# EAGLE design siggen1modified (EAGLE 4.16)
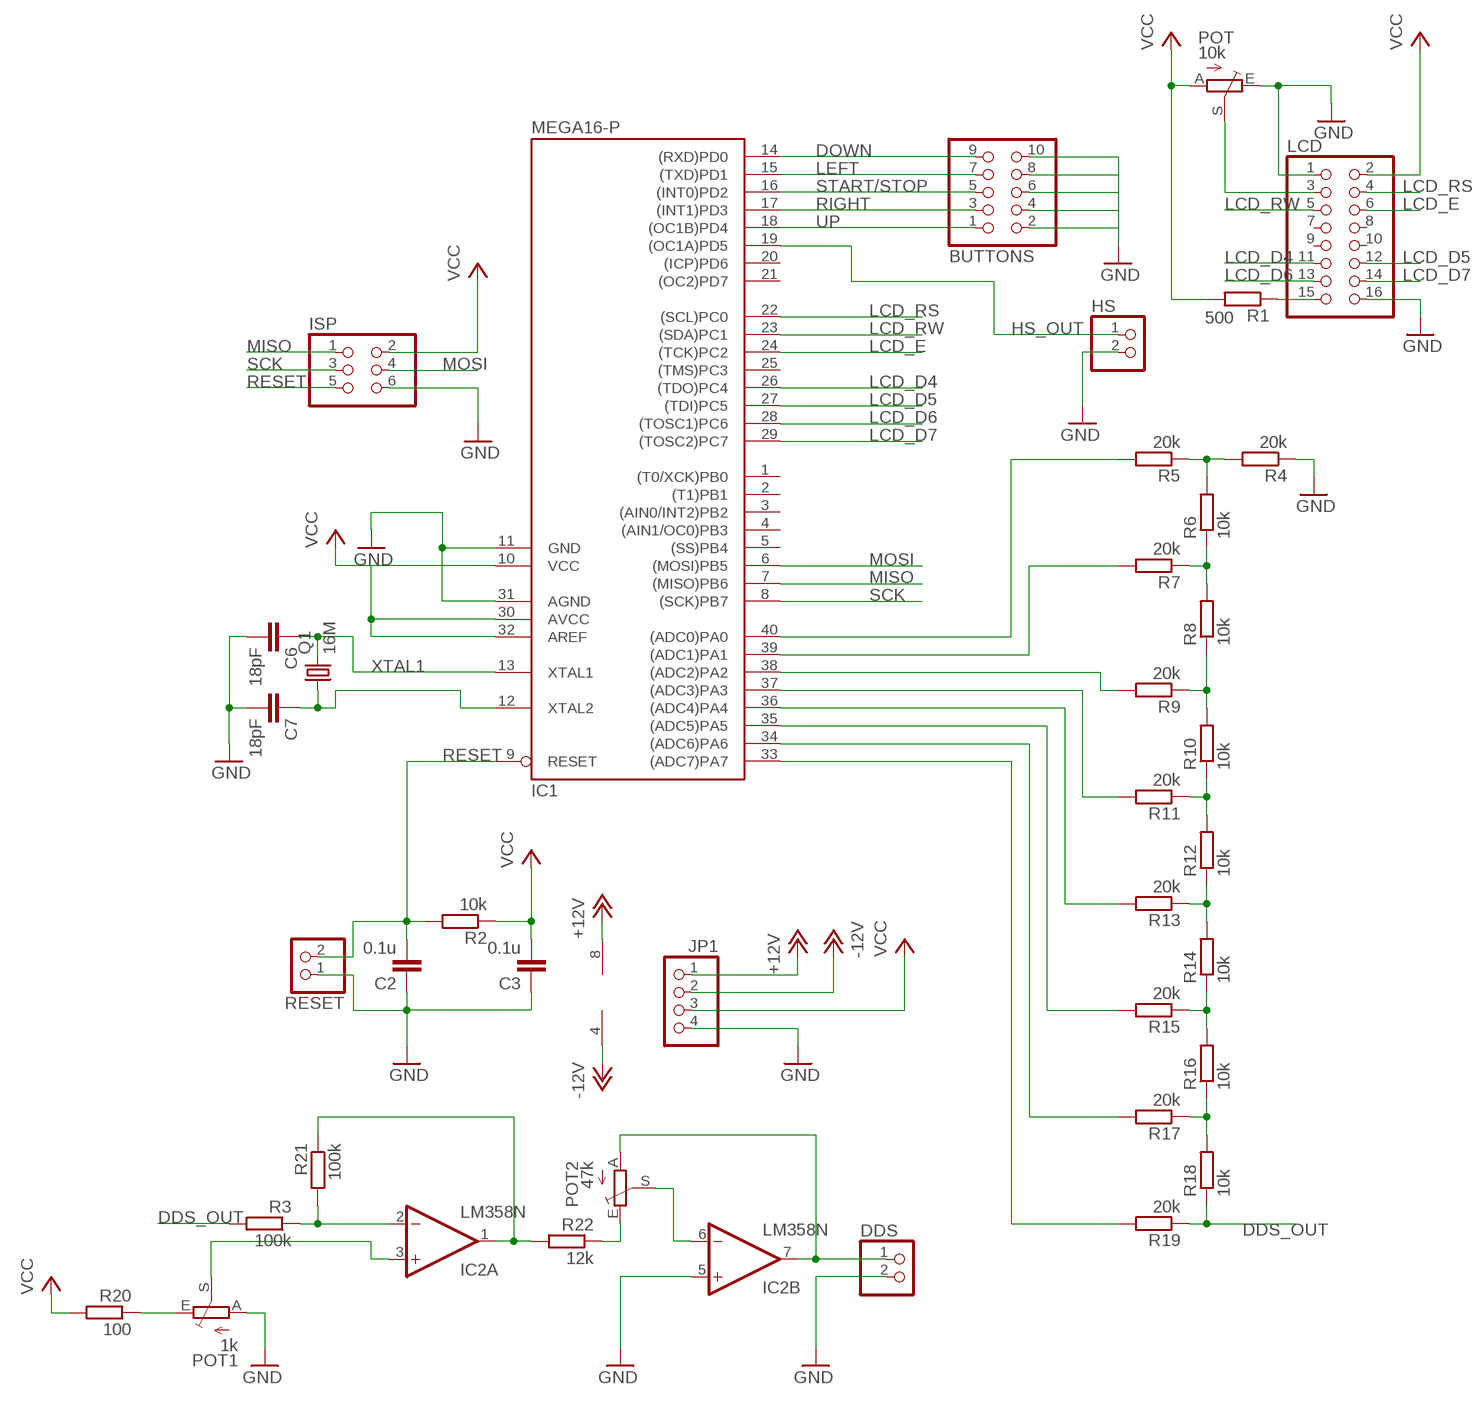
[diagram p0: schematic, sheet 1]

## Parts
BUTTONS  PINHD-2X5  [2X05]
C2  0.1u  C-EUC0805  [C0805]
C3  0.1u  C-EUC0805  [C0805]
C6  18pF  C-EUC0805  [C0805]
C7  18pF  C-EUC0805  [C0805]
DDS  PINHD-1X2  [1X02]
HS  PINHD-1X2  [1X02]
IC1  MEGA16-P  [DIL40]
IC2  LM358N  [DIL08]
ISP  PINHD-2X3  [2X03]
JP1  PINHD-1X4  [1X04]
LCD  PINHD-2X8  [2X08]
POT  10k  TRIM_EU-B64W  [B64W]
POT1  1k  TRIM_EU-B64W  [B64W]
POT2  47k  TRIM_EU-B64W  [B64W]
Q1  16M  CRYTALHC49S  [HC49/S]
R1  500  R-EU_M0805  [M0805]
R2  10k  R-EU_R0805  [R0805]
R3  100k  R-EU_M0805  [M0805]
R4  20k  R-EU_M0805  [M0805]
R5  20k  R-EU_M0805  [M0805]
R6  10k  R-EU_M0805  [M0805]
R7  20k  R-EU_M0805  [M0805]
R8  10k  R-EU_M0805  [M0805]
R9  20k  R-EU_M0805  [M0805]
R10  10k  R-EU_M0805  [M0805]
R11  20k  R-EU_M0805  [M0805]
R12  10k  R-EU_M0805  [M0805]
R13  20k  R-EU_M0805  [M0805]
R14  10k  R-EU_M0805  [M0805]
R15  20k  R-EU_M0805  [M0805]
R16  10k  R-EU_M0805  [M0805]
R17  20k  R-EU_M0805  [M0805]
R18  10k  R-EU_M0805  [M0805]
R19  20k  R-EU_M0805  [M0805]
R20  100  R-EU_M0805  [M0805]
R21  100k  R-EU_M0805  [M0805]
R22  12k  R-EU_M0805  [M0805]
RESET  PINHD-1X2  [1X02]

## Nets
+12V: IC2.8(P:V+) JP1.1
-12V: IC2.4(P:V-) JP1.2
DDS_OUT: R3.2 R18.1 R19.1
DOWN: BUTTONS.9 IC1.14((RXD)PD0)
GND: BUTTONS.2 BUTTONS.4 BUTTONS.6 BUTTONS.8 BUTTONS.10 C2.1 C3.1 C6.2 C7.2 DDS.2 HS.2 IC1.11(GND) IC1.31(AGND) IC2.5(B:+IN) ISP.6 JP1.4 LCD.1 LCD.16 POT1.A POT.E R4.1 RESET.1
HS_OUT: HS.1 IC1.19((OC1A)PD5)
LCD_D4: IC1.26((TDO)PC4) LCD.11
LCD_D5: IC1.27((TDI)PC5) LCD.12
LCD_D6: IC1.28((TOSC1)PC6) LCD.13
LCD_D7: IC1.29((TOSC2)PC7) LCD.14
LCD_E: IC1.24((TCK)PC2) LCD.6
LCD_RS: IC1.22((SCL)PC0) LCD.4
LCD_RW: IC1.23((SDA)PC1) LCD.5
LEFT: BUTTONS.7 IC1.15((TXD)PD1)
MISO: IC1.7((MISO)PB6) ISP.1
MOSI: IC1.6((MOSI)PB5) ISP.4
N$1: IC1.40((ADC0)PA0) R5.2
N$2: LCD.3 POT.S
N$3: IC2.2(A:-IN) R3.1 R21.2
N$5: LCD.15 R1.1
N$6: IC1.39((ADC1)PA1) R7.2
N$7: IC1.33((ADC7)PA7) R19.2
N$8: IC1.34((ADC6)PA6) R17.2
N$9: IC1.35((ADC5)PA5) R15.2
N$10: IC1.36((ADC4)PA4) R13.2
N$11: IC1.37((ADC3)PA3) R11.2
N$12: IC1.38((ADC2)PA2) R9.2
N$13: POT2.E R22.1
N$14: IC2.3(A:+IN) POT1.S
N$15: R4.2 R5.1 R6.2
N$16: IC2.1(A:OUT) R21.1 R22.2
N$17: POT1.E R20.1
N$18: R6.1 R7.1 R8.2
N$19: DDS.1 IC2.7(B:OUT) POT2.A
N$20: R8.1 R9.1 R10.2
N$21: R10.1 R11.1 R12.2
N$22: R12.1 R13.1 R14.2
N$23: R14.1 R15.1 R16.2
N$24: R16.1 R17.1 R18.2
N$25: IC2.6(B:-IN) POT2.S
N$29: C7.1 IC1.12(XTAL2) Q1.1
RESET: C2.2 IC1.9(RESET) ISP.5 R2.2 RESET.2
RIGHT: BUTTONS.3 IC1.17((INT1)PD3)
SCK: IC1.8((SCK)PB7) ISP.3
START/STOP: BUTTONS.5 IC1.16((INT0)PD2)
UP: BUTTONS.1 IC1.18((OC1B)PD4)
VCC: C3.2 IC1.10(VCC) IC1.30(AVCC) IC1.32(AREF) ISP.2 JP1.3 LCD.2 POT.A R1.2 R2.1 R20.2
XTAL1: C6.1 IC1.13(XTAL1) Q1.2
Unconnected: IC1.1((T0/XCK)PB0) IC1.2((T1)PB1) IC1.3((AIN0/INT2)PB2) IC1.4((AIN1/OC0)PB3) IC1.5((SS)PB4) IC1.20((ICP)PD6) IC1.21((OC2)PD7) IC1.25((TMS)PC3) LCD.7 LCD.8 LCD.9 LCD.10

## Library data of the parts
BUTTONS = pinhead:PINHD-2X5: PIN HEADER
C2 C3 C6 C7 = rcl:C-EU: CAPACITOR, European symbol
DDS HS RESET = pinhead:PINHD-1X2: PIN HEADER
IC1 = atmel:MEGA16-P: MICROCONTROLLER 16 Kbytes FLASH 1 kbytes SRAM 512 bytes EEPROM USART 8-channel 10 bit ADC Source: avr.lbr
IC2 = linear:LM358: OP AMP also LM158; LM258; LM2904 Source: http://cache.national.com/ds/LM/LM158.pdf
ISP = pinhead:PINHD-2X3: PIN HEADER
JP1 = pinhead:PINHD-1X4: PIN HEADER
LCD = pinhead:PINHD-2X8: PIN HEADER
POT POT1 POT2 = pot:TRIM_EU-: POTENTIOMETER
Q1 = crystal:CRYTAL: CRYSTAL
R1-R22 = rcl:R-EU_: RESISTOR, European symbol

## Board
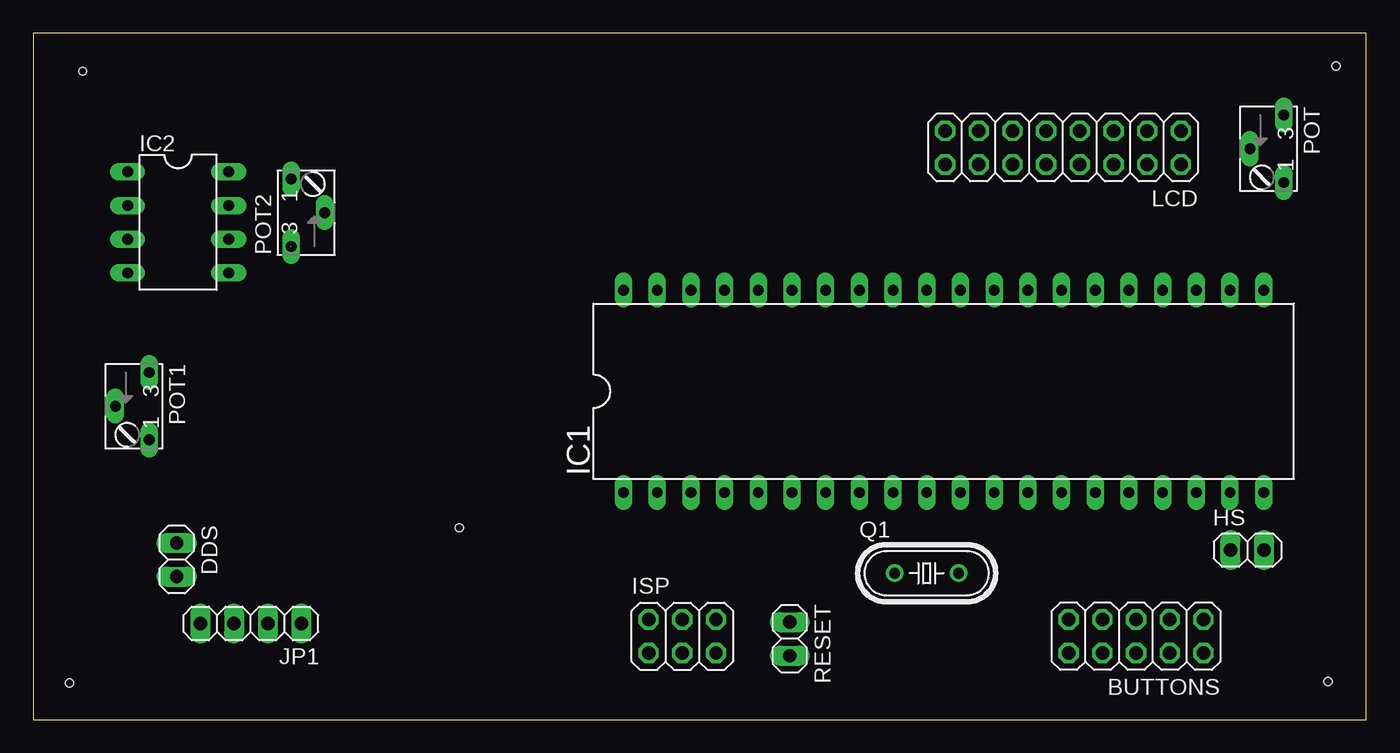
[diagram p1: board, top side]
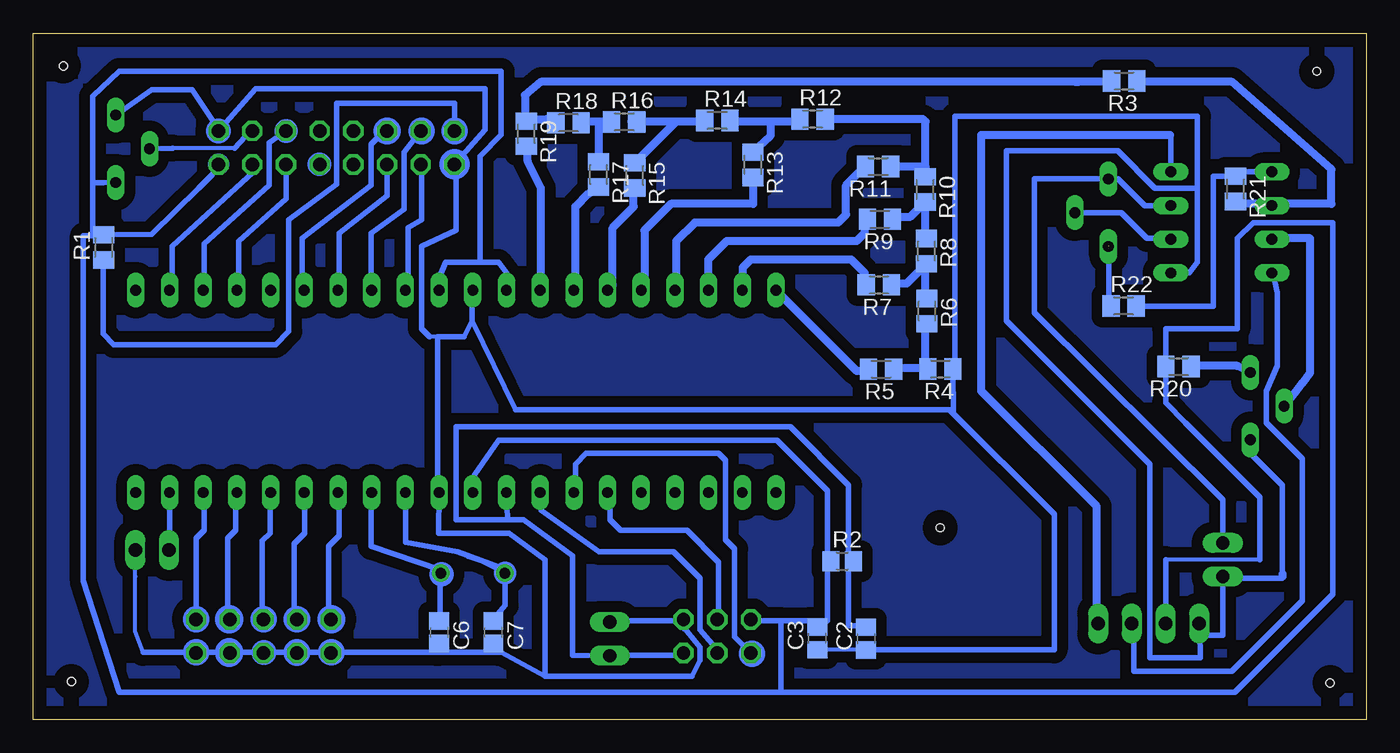
[diagram p2: board, bottom side, seen from below]

Size 100.51 x 51.74 mm. Coordinates in mm from the lower left corner, seen from the top.
Outline: 0,0 100.51,0 100.51,51.74 0,51.74 0,0
Copper layers (1*16): Top 0.035mm / dielectric 1.5mm / Bottom 0.035mm
Design rules "default": minimum track width 10mil, minimum drill 24mil, track to track 8mil, track to pad 8mil, pad to pad 8mil, via to via 8mil, smd to smd 8mil, copper to edge 40mil, drill to drill 8mil, minimum pad ring 10mil, minimum via ring 8mil, stop-mask expansion 4mil, vias tented up to drill 0mil, thermal gap 10mil
Holes 0.6 mm at 32.13,14.47 97.63,2.87 32.13,14.47 98.23,49.27 3.73,48.87 2.73,2.77 98.23,49.27 97.63,2.87

### Footprints (pad centres in the part's own frame; a part is rotated, then mirrored left to right if it is on the bottom)
2X05 = drill 1.016 octagon: 1 -5.08,-1.27; 2 -5.08,1.27; 3 -2.54,-1.27; 4 -2.54,1.27; 5 0,-1.27; 6 0,1.27; 7 2.54,-1.27; 8 2.54,1.27; 9 5.08,-1.27; 10 5.08,1.27
C0805 = smd 1.3 x 1.5: 1 -0.85,0; 2 0.85,0
1X02 = drill 1.016 long: 1 -1.27,0; 2 1.27,0
DIL40 = drill 0.813 long: 1 -24.13,-7.62; 2 -21.59,-7.62; 3 -19.05,-7.62; 4 -16.51,-7.62; 5 -13.97,-7.62; 6 -11.43,-7.62; 7 -8.89,-7.62; 8 -6.35,-7.62; 9 -3.81,-7.62; 10 -1.27,-7.62; 11 1.27,-7.62; 12 3.81,-7.62; 13 6.35,-7.62; 14 8.89,-7.62; 15 11.43,-7.62; 16 13.97,-7.62; 17 16.51,-7.62; 18 19.05,-7.62; 19 21.59,-7.62; 20 24.13,-7.62; 21 24.13,7.62; 22 21.59,7.62; 23 19.05,7.62; 24 16.51,7.62; 25 13.97,7.62; 26 11.43,7.62; 27 8.89,7.62; 28 6.35,7.62; 29 3.81,7.62; 30 1.27,7.62; 31 -1.27,7.62; 32 -3.81,7.62; 33 -6.35,7.62; 34 -8.89,7.62; 35 -11.43,7.62; 36 -13.97,7.62; 37 -16.51,7.62; 38 -19.05,7.62; 39 -21.59,7.62; 40 -24.13,7.62
DIL08 = drill 0.813 long: 1 -3.81,-3.81; 2 -1.27,-3.81; 3 1.27,-3.81; 4 3.81,-3.81; 5 3.81,3.81; 6 1.27,3.81; 7 -1.27,3.81; 8 -3.81,3.81
2X03 = drill 1.016 octagon: 1 -2.54,-1.27; 2 -2.54,1.27; 3 0,-1.27; 4 0,1.27; 5 2.54,-1.27; 6 2.54,1.27
1X04 = drill 1.016 long: 1 -3.81,0; 2 -1.27,0; 3 1.27,0; 4 3.81,0
2X08 = drill 1.016 octagon: 1 -8.89,-1.27; 2 -8.89,1.27; 3 -6.35,-1.27; 4 -6.35,1.27; 5 -3.81,-1.27; 6 -3.81,1.27; 7 -1.27,-1.27; 8 -1.27,1.27; 9 1.27,-1.27; 10 1.27,1.27; 11 3.81,-1.27; 12 3.81,1.27; 13 6.35,-1.27; 14 6.35,1.27; 15 8.89,-1.27; 16 8.89,1.27
B64W = drill 0.813 long: A 2.54,0; E -2.54,0; S 0,-2.54
HC49/S = drill 0.813 round: 1 -2.413,0; 2 2.413,0
M0805 = smd 1.3 x 1.6: 1 -0.95,0; 2 0.95,0
R0805 = smd 1.3 x 1.5: 1 -0.85,0; 2 0.85,0

### Placement (x,y rotation side)
BUTTONS  83.15,6.29 180 top
C2  37.72,6.11 90 bottom
C3  41.39,6.13 90 bottom
C6  69.9,6.59 270 bottom
C7  65.82,6.59 270 bottom
DDS  10.82,12.06 270 top
HS  91.54,12.78 0 top
IC1  68.64,24.75 0 top
IC2  10.93,37.48 270 top
ISP  48.94,6.29 0 top
JP1  16.41,7.25 180 top
LCD  77.64,43.11 180 top
POT  94.28,43.03 270 top
POT1  8.74,23.63 270 top
POT2  19.44,38.21 90 top
Q1  67.36,11.04 0 top
R1  95.2,35.6 90 bottom
R2  39.51,11.95 0 bottom
R3  18.26,48.14 180 bottom
R4  32.11,26.43 180 bottom
R5  36.59,26.41 180 bottom
R6  33.13,30.8 270 bottom
R7  36.75,32.77 180 bottom
R8  33.17,35.31 270 bottom
R9  36.67,37.71 180 bottom
R10  33.26,39.97 270 bottom
R11  36.81,41.69 180 bottom
R12  41.75,45.26 0 bottom
R13  46.25,41.82 270 bottom
R14  48.93,45.16 0 bottom
R15  55.15,41.02 270 bottom
R16  55.95,45.04 0 bottom
R17  57.89,41.1 270 bottom
R18  60.16,44.98 0 bottom
R19  63.33,44.16 270 bottom
R20  14.16,26.62 180 bottom
R21  9.86,40 270 bottom
R22  18.3,31.18 0 bottom
RESET  57.04,6.09 270 top

### Tracks (layer width: path | path; a pad name or v marks a point on that pad's centre or on a via)
+12V
  Bottom 0.406: IC2.8 14.73,44.07 14.78,44.07
  Bottom 0.61: 14.78,44.07 29.03,44.07 29.03,24.77 20.33,16.07 20.33,6.24 | 20.33,6.24 20.33,6.17 | JP1.1 20.33,6.24
-12V
  Bottom 0.305: 17.53,6.4 JP1.2 | 7.03,33.57 6.98,33.67
  Bottom 0.406: 17.53,6.4 17.53,3.67 10.13,3.67 4.83,8.97 4.83,19.67 7.53,22.37 7.53,24.77 6.73,26.67 6.73,32.17 7.03,33.57 IC2.4
DDS_OUT
  Bottom 0.61: R18.1 61.8,45.27 63.37,45.27 R19.1 63.29,45.07 63.43,45.07 63.43,47.07 62.23,48.07 21.93,48.07 | 21.93,48.07 21.74,48.07 | R3.2 19.28,48.07 21.93,48.07
DOWN
  Bottom 0.305: BUTTONS.9 78.23,7.72 | 77.43,17.07 77.47,17.07 IC1.14
  Bottom 0.406: 78.23,7.72 78.23,13.07 77.43,13.87 77.43,17.07
GND
  Bottom 0.254: C7.2 65.43,5.07 | C6.2 69.93,5.07 | 77.43,5.07 BUTTONS.10 | 51.23,6.67 51.43,6.87 | 31.03,27.17 R4.1
  Bottom 0.305: IC1.31 67.43,31.31 67.43,30.07 | 70.03,28.87 70.63,28.87 | 68.63,41.92 68.73,42.07 | 68.73,42.07 LCD.16 68.63,41.86 68.73,42.07 | LCD.1 86.73,44.77 | 68.73,42.07 68.73,41.87 | 88.43,5.07 BUTTONS.2 88.08,5.07 | 92.22,5.07 92.83,6.67 92.81,10.79 HS.2 | 85.83,5.07 85.83,4.88 BUTTONS.4 85.64,5.07 | 83.2,5.07 BUTTONS.6 83,5.07 | 80.43,4.87 80.46,5.07 BUTTONS.8 80.56,5.07 | 78.03,5.07 78.03,5.06 BUTTONS.10 | 51.43,7.47 51.43,7.51 ISP.6 | 56.93,7.47 RESET.1 | 12.53,6.37 12.53,6.42 JP1.4 | C3.1 41.43,5.27 | C3.1 | C3.1 C2.1 37.63,5.17
  Bottom 0.406: 8.83,20.17 6.33,17.67 6.33,10.97 6.33,10.67 10.93,10.67 10.93,10.79 DDS.2 10.83,6.37 12.53,6.37 | 6.33,10.8 6.33,10.77 | 67.43,30.07 68.03,28.87 70.03,28.87 70.03,18.27 IC1.11 69.93,14.07 64.63,14.07 61.93,12.07 61.93,3.27 | 70.63,28.87 71.23,29.47 71.23,35.67 68.63,36.87 68.63,41.86 68.63,41.92 | POT.E 91.58,47.47 88.53,47.47 86.73,44.77 | LCD.1 83.74,47.57 66.43,47.57 66.43,44.47 68.73,41.87 | 88.43,5.07 92.22,5.07 | 85.83,5.07 88.08,5.07 | 83.2,5.07 85.64,5.07 | 80.46,5.07 83,5.07 | 78.03,5.07 80.46,5.07 | 80.46,5.07 80.56,5.07 | 51.43,7.47 56.93,7.47 | R4.1 31.13,23.1 31.43,23.37 | 31.43,23.37 23.53,15.47 23.53,5.27 C2.1 | 65.43,5.07 69.93,5.07 | C6.2 70.13,5.07 69.93,5.07 | 69.93,5.07 77.43,5.07 | 51.23,6.67 50.23,5.47 50.23,4.47 50.83,3.27 61.93,3.27 | 61.93,3.27 65.23,5.07 C7.2 | 51.43,6.87 ISP.6 | 12.73,40.07 12.73,34.47 13.33,33.67 IC2.5 14.83,33.67 | 12.73,40.07 12.73,45.47 31.03,45.47 31.03,27.17 | 12.73,40.07 15.93,40.07 18.73,42.87 27.13,42.87 27.13,30.07 16.33,19.27 16.33,4.67 12.53,4.67 12.53,5.17 JP1.4 | 67.43,30.07 67.43,31.47 IC1.31 | 67.43,30.07 64.13,23.37 31.43,23.37
  Bottom 0.61: POT1.A 8.83,20.38 8.83,20.17 | 6.33,10.97 6.33,10.8
HS_OUT
  Bottom 0.305: 90.23,12.77 90.23,13.04 HS.1
  Bottom 0.406: 90.23,12.77 IC1.19
LCD_D4
  Bottom 0.305: IC1.26 80.23,32.53 | 73.63,44.77 73.74,44.47 LCD.11
  Bottom 0.406: 80.23,32.53 80.23,36.27 75.03,40.27 75.03,43.37 73.63,44.77
LCD_D5
  Bottom 0.305: IC1.27 77.43,32.47 | 73.83,41.77 73.8,41.77 LCD.12
  Bottom 0.406: 77.43,32.47 77.43,36.67 73.83,39.47 73.83,41.77
LCD_D6
  Bottom 0.305: IC1.28 75.03,32.41 | 71.23,44.47 71.23,44.44 LCD.13
  Bottom 0.406: 75.03,32.41 75.03,36.67 72.53,38.47 72.53,42.77 71.23,44.47
LCD_D7
  Bottom 0.305: IC1.29 72.23,32.59 | 71.23,41.8 LCD.14
  Bottom 0.406: 72.23,32.59 72.23,37.07 71.23,37.67 71.23,41.8
LCD_E
  Bottom 0.305: IC1.24 85.03,32.49 | 81.43,41.86 LCD.6
  Bottom 0.406: 85.03,32.49 85.03,36.07 81.43,39.27 81.43,41.86
LCD_RS
  Bottom 0.305: IC1.22 90.03,32.57 | 83.93,41.77 83.96,41.87 LCD.4
  Bottom 0.406: 90.03,32.57 90.03,35.67 83.93,41.27 83.93,41.77
LCD_RW
  Bottom 0.305: IC1.23 87.63,32.43 | 81.43,44.37 LCD.5
  Bottom 0.406: 87.63,32.43 87.63,35.87 82.73,40.27 82.73,43.47 81.43,44.37
LEFT
  Bottom 0.305: BUTTONS.7 80.83,7.78 | 80.03,17.09 IC1.15
  Bottom 0.406: 80.83,7.78 80.83,13.27 80.03,14.07 80.03,17.09
MISO
  Bottom 0.305: 59.63,17.25 IC1.7 | 46.43,5.07 46.43,5.05 ISP.1
  Bottom 0.406: 59.63,17.25 59.63,19.27 58.83,20.07 48.83,20.07 48.33,19.57 48.33,13.57 47.63,12.87 47.63,6.27 46.43,5.07
MOSI
  Bottom 0.305: 57.03,16.95 IC1.6 | 48.83,7.67 ISP.4
  Bottom 0.406: 57.03,16.95 57.03,15.07 56.23,14.27 51.23,14.27 48.83,11.87 48.83,7.67
N$1
  Bottom 0.61: R5.2 37.43,26.3 37.43,26.27 38.41,26.27 IC1.40
N$2
  Bottom 0.305: 85.33,43.07 90,43.07 | LCD.3 84.03,44.42 84.03,44.27 84.13,44.37
  Bottom 0.406: 90,43.07 POT.S | 84.13,44.37 85.33,43.07
N$3
  Bottom 0.406: IC2.2 7.13,38.77 7.13,38.87
  Bottom 0.61: R21.2 10.13,38.92 10.13,38.87 7.13,38.87 | R3.1 17.24,48.07 10.13,48.07 2.63,41.47 2.63,38.87 7.13,38.87 | 7.13,38.87 7.1,38.87
N$4
  pour Bottom (isolate 0.813): 0.23,51.67 100.43,51.87 100.43,0.07 0.03,0.07
N$5
  Bottom 0.305: R1.1 95.28,34.57 95.13,34.17 95.23,34.57 95.23,34.17
  Bottom 0.406: LCD.15 68.74,46.47 77.63,46.47 77.63,40.37 81.23,37.67 81.23,29.27 82.23,28.27 94.43,28.27 95.23,29.07 95.23,34.17
N$6
  Bottom 0.61: IC1.39 47.03,32.39 47.03,34.07 46.43,34.67 38.83,34.67 37.83,33.67 37.83,32.87 37.8,32.87 R7.2
N$7
  Bottom 0.61: IC1.33 62.23,32.43 62.23,40.07 63.23,42.07 63.23,43.11 R19.2
N$8
  Bottom 0.61: IC1.34 59.63,32.49 59.63,38.67 58.63,39.67 58.57,39.67 R17.2
N$9
  Bottom 0.61: IC1.35 56.83,32.75 56.83,37.07 55.23,38.67 55.23,40.07 R15.2
N$10
  Bottom 0.61: IC1.36 54.43,32.61 54.43,36.87 52.43,38.87 46.23,38.87 46.23,40.85 R13.2
N$11
  Bottom 0.61: IC1.37 52.03,32.47 52.03,36.07 50.63,37.47 39.83,37.47 39.23,38.07 39.23,40.27 38.03,41.47 38.03,41.67 37.78,41.67 R11.2
N$12
  Bottom 0.61: IC1.38 49.63,32.41 49.63,34.67 48.23,36.07 38.43,36.07 37.83,36.67 37.83,37.5 R9.2
N$13  (1 unrouted)
  Bottom 0.406: 19.43,35.65 POT2.E 19.43,31.18 R22.1
N$14
  Bottom 0.406: 7.13,36.17 7.12,36.18 | 7.12,36.18 IC2.3 | 7,36.27 7.03,36.27 7.12,36.18
  Bottom 0.61: 7,36.27 4.23,36.27 4.23,26.17 4.83,25.37 5.44,24.57 POT1.S
N$15
  Bottom 0.61: R5.1 35.58,26.47 33.1,26.47 R4.2 33.23,26.6 33.23,29.75 R6.2
N$16
  Bottom 0.406: IC2.1 9.83,41.29 9.83,40.95 R21.1 11.53,40.95 11.53,31.17 17.23,31.17 17.23,31.18 R22.2
N$17
  Bottom 0.61: R20.1 13.16,26.67 9.74,26.67 POT1.E
N$18
  Bottom 0.61: R7.1 35.83,32.8 35.83,32.87 34.66,32.87 R8.2 33.23,34.3 33.23,31.85 R6.1
N$19
  Bottom 0.406: IC2.7 16.71,38.75 18.73,40.77 19.53,40.77 | 19.53,40.77 POT2.A 19.44,40.68 | DDS.1 10.82,16.56 25.03,30.67 25.03,40.77 19.53,40.77 | 19.44,40.68 19.43,40.67 | 19.53,40.77 19.44,40.68
N$20
  Bottom 0.61: R8.1 33.23,36.32 33.23,38.99 R10.2 34.41,37.87 35.63,37.87 35.63,37.8 R9.1
N$21
  Bottom 0.61: R12.2 39.59,45.27 33.43,45.27 33.23,45.07 33.23,41.67 | 33.23,40.89 33.23,40.67 | R10.1 33.23,40.89 | 33.23,40.89 33.23,41.67 | R11.1 35.84,41.67 33.23,41.67
N$22
  Bottom 0.61: 42.91,45.07 R12.1 42.89,45.07 42.91,45.07 | R13.1 44.93,43.99 44.93,45.07 | R14.2 47.89,45.07 44.93,45.07 | 42.91,45.07 44.93,45.07
N$23
  Bottom 0.61: R15.1 52.05,45.07 49.97,45.07 | R16.2 55.43,45.07 49.97,45.07 | R14.1 49.97,45.07
N$24
  Bottom 0.61: 57.83,45.07 57.67,45.07 R16.1 | R17.1 57.83,42.31 57.83,45.07 | R18.2 59.3,45.07 57.83,45.07
N$25
  Bottom 0.406: POT2.S 18.47,38.21 16.53,36.27 14.73,36.27 14.74,36.26 IC2.6
N$29
  Bottom 0.305: Q1.1 66.58,11.87 67.73,12.27 65.03,11.37 | C7.1 65.83,7.55
  Bottom 0.406: IC1.12 72.43,15.51 72.43,13.37 68.53,12.67 65.03,11.37 | Q1.1 64.93,8.62 65.83,7.55
RESET
  Bottom 0.254: C2.2 37.83,7.07
  Bottom 0.305: 51.43,4.87 51.43,4.97 ISP.5 | RESET.2 56.99,4.87
  Bottom 0.406: 56.99,4.87 51.43,4.87 | 64.73,15.07 63.53,15.07 59.83,12.37 59.83,4.87 RESET.2 | 64.73,15.07 IC1.9 | 64.73,15.07 68.63,15.07 68.63,22.07 43.43,22.07 39.03,17.67 39.03,11.67 | 37.83,7.07 39.03,7.07 39.03,11.67 | R2.2 38.63,11.95 38.63,11.67 39.03,11.67
RIGHT
  Bottom 0.305: BUTTONS.3 85.83,7.7 | 85.23,17.07 85.21,17.07 IC1.17
  Bottom 0.406: 85.83,7.7 85.83,13.67 85.23,14.27 85.23,17.07
SCK
  Bottom 0.305: IC1.8 62.23,17.07 62.23,15.77 | 48.83,5.07 48.89,5.07 | 48.89,5.07 ISP.3 | 48.89,5.07 48.83,5.17
  Bottom 0.406: 62.23,15.77 57.83,12.67 52.23,12.67 50.23,10.67 50.23,6.77 48.83,5.17
START/STOP
  Bottom 0.305: BUTTONS.5 83.23,7.64 | 82.63,17.11 IC1.16
  Bottom 0.406: 83.23,7.64 83.23,13.47 82.63,14.07 82.63,17.11
UP
  Bottom 0.305: 87.63,17.07 IC1.18
  Bottom 0.406: BUTTONS.1 88.23,13.67 87.63,14.27 87.63,17.07
VCC
  Bottom 0.254: 40.63,7.47 40.83,7.47 C3.2 42.03,7.47 | 67.23,18.47 67.23,18.27 | 45.83,7.47 ISP.2 | 95.73,36.47 R1.2
  Bottom 0.305: 96.03,36.77 95.08,36.87 R1.2 | 86.53,41.87 LCD.2 | 15.13,6.54 JP1.3 | 8.03,12.07 15.13,12.07
  Bottom 0.406: 96.03,36.77 96.03,40.44 POT.A 96.03,40.47 96.03,46.97 94.03,48.87 65.23,48.87 65.23,44.07 66.83,42.47 66.83,34.47 | R1.2 91.58,36.57 88.03,40.07 87.03,41.07 86.53,41.87 | 8.03,12.07 8.03,16.77 13.63,22.37 15.13,23.9 R20.2 15.11,28.45 15.13,29.47 9.73,29.47 9.73,36.27 8.53,37.47 2.53,37.47 2.53,9.47 9.93,2.07 44.13,2.07 | 15.13,12.07 15.13,6.54 | 67.23,18.47 65.43,21.07 44.43,21.07 40.63,17.27 40.63,12.47 40.43,12.47 40.43,11.95 | 67.23,18.27 IC1.10 | 44.13,7.47 42.03,7.47 | 44.13,7.47 45.83,7.47 | 66.83,34.47 65.43,34.47 64.83,33.67 IC1.32 | 66.83,34.47 69.43,34.47 69.83,33.47 IC1.30 | 44.13,2.07 94.03,2.07 96.73,10.47 96.73,36.47 95.73,36.47 | 40.63,7.47 40.63,11.97 40.43,11.95 | 40.43,11.95 40.63,11.95 40.63,7.47 | 40.43,11.95 R2.1 | 44.13,7.47 40.63,7.47 | 44.13,2.07 44.13,7.47
XTAL1
  Bottom 0.305: 75.03,17.09 IC1.13 | C6.1 69.83,7.11 | Q1.2 69.83,11.38
  Bottom 0.406: 69.83,11.3 Q1.2 | 75.03,17.09 75.03,13.07 69.83,11.3 | 69.83,7.11 69.83,11.3 | 69.83,11.3 69.83,11.38
(copper drawn outside any net)
  shapes: Bottom circle x55